# Altium schematic sheet LoRa.SchDoc
size A4; SheetNumber: 5; SheetTotal: 5
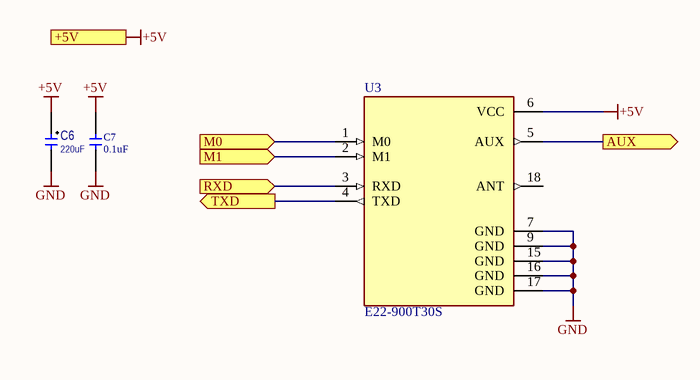
[diagram p0: LoRa.SchDoc]

## Parts
C6  value 220uF  [TECAP C]
C7  value 0.1uF  [CERCAP 0402]
U3  E22-900T30S  [E22-900T30S]

## Ports
+5V, AUX (out), M0 (in), M1 (in), RXD (in), TXD (out)

## Nets
+5V: C6.1(+) C7.2 U3.6(VCC) ; port +5V
GND: C6.2(-) C7.1 U3.7(GND) U3.9(GND) U3.15(GND) U3.16(GND) U3.17(GND)
AUX: U3.5(AUX) ; port AUX
M0: U3.1(M0) ; port M0
M1: U3.2(M1) ; port M1
RXD: U3.3(RXD) ; port RXD
TXD: U3.4(TXD) ; port TXD

Not connected (* = marked no-connect by the designer): U3 18(ANT)

## Library data of the parts
C6 = CapacitorP: Capacitor Polar; IsSMT: NoSMT; Diel: X7R; Voltage: *
C7 = !Capacitor: Capacitor; IsSMT: NoSMT; Diel: X7R; Voltage: *
U3 = E22-900T30S: LORA RF